# EAGLE design sanguino_breakout (EAGLE 5.02)
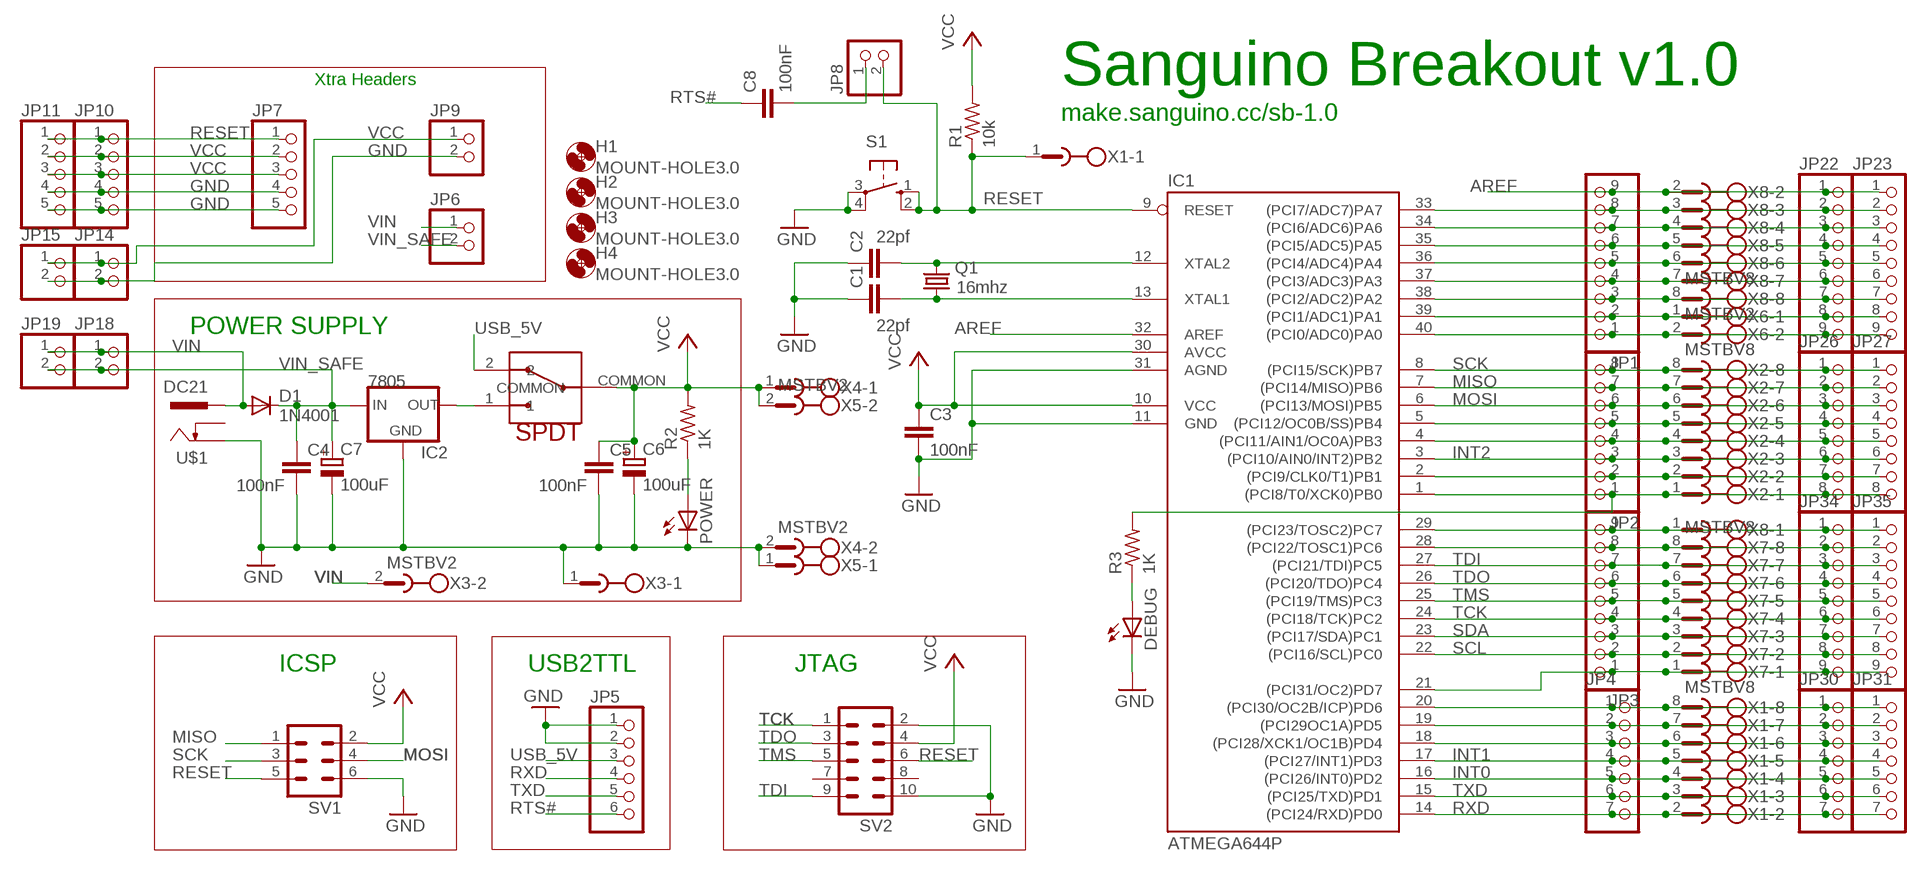
[diagram p0: schematic, sheet 1]

## Parts
C1  22pf  C-EU025-025X050  [C025-025X050]
C2  22pf  C-EU025-025X050  [C025-025X050]
C3  100nF  C-EU050-030X075  [C050-030X075]
C4  100nF  C-EU050-030X075  [C050-030X075]
C5  100nF  C-EU050-030X075  [C050-030X075]
C6  100uF  CPOL-EUE2.5-6  [E2,5-6]
C7  100uF  CPOL-EUE2.5-6  [E2,5-6]
C8  100nF  C-EU050-030X075  [C050-030X075]
D1  1N4001  1N4004  [DO41-10]
DEBUG  LED3MM  [LED3MM]
H1  MOUNT-HOLE3.0  [3,0]
H2  MOUNT-HOLE3.0  [3,0]
H3  MOUNT-HOLE3.0  [3,0]
H4  MOUNT-HOLE3.0  [3,0]
IC1  ATMEGA644P  ATMEGA644-20P  [DIL40]
IC2  7805  V_REG_78XXSINK  [TO220-IGO]
JP1  PINHD-1X9  [1X09]
JP2  PINHD-1X8  [1X08]
JP3  PINHD-1X9  [1X09]
JP4  PINHD-1X7  [1X07]
JP5  PINHD-1X6  [1X06]
JP6  PINHD-1X2  [1X02]
JP7  PINHD-1X5  [1X05]
JP8  PINHD-1X2  [1X02]
JP9  PINHD-1X2  [1X02]
JP10  PINHD-1X5  [1X05]
JP11  PINHD-1X5  [1X05]
JP14  PINHD-1X2  [1X02]
JP15  PINHD-1X2  [1X02]
JP18  PINHD-1X2  [1X02]
JP19  PINHD-1X2  [1X02]
JP22  PINHD-1X9  [1X09]
JP23  PINHD-1X9  [1X09]
JP26  PINHD-1X8  [1X08]
JP27  PINHD-1X8  [1X08]
JP30  PINHD-1X7  [1X07]
JP31  PINHD-1X7  [1X07]
JP34  PINHD-1X9  [1X09]
JP35  PINHD-1X9  [1X09]
POWER  LED3MM  [LED3MM]
Q1  16mhz  CRYSTALHC49S  [HC49/S]
R1  10k  R-US_0207/7  [0207/7]
R2  1K  R-US_0207/2V  [0207/2V]
R3  1K  R-US_0207/2V  [0207/2V]
S1  10-XX  [B3F-10XX]
SV1  ML6  [ML6]
SV2  ML10  [ML10]
U$1  DC21  [DCSKT]
U$2  SPDT  [10SP001]
X1  MSTBV8  [MSTBV8]
X2  MSTBV8  [MSTBV8]
X3  MSTBV2  [MSTBV2]
X4  MSTBV2  [MSTBV2]
X5  MSTBV2  [MSTBV2]
X6  MSTBV2  [MSTBV2]
X7  MSTBV8  [MSTBV8]
X8  MSTBV8  [MSTBV8]

## Nets
AREF: IC1.32(AREF) JP1.9 JP22.1 JP23.1 X8.2
GND [power]: C1.1 C2.1 C3.2 C4.2 C5.2 C6.- C7.- DEBUG.K(C) IC1.11(GND) IC1.31(AGND) IC2.GND JP5.1 JP5.2 JP7.4 JP7.5 JP9.2 JP10.4 JP10.5 JP11.4 JP11.5 JP14.2 JP15.2 POWER.K(C) S1.3(P) S1.4(P1) SV1.6 SV2.2 SV2.10 U$1.2 X3.1 X4.2 X5.1
INT0: IC1.16((PCI26/INT0)PD2) JP4.5 JP30.5 JP31.5 X1.4
INT1: IC1.17((PCI27/INT1)PD3) JP4.4 JP30.4 JP31.4 X1.5
INT2: IC1.3((PCI10/AIN0/INT2)PB2) JP2.3 JP26.6 JP27.6 X2.3
MISO: IC1.7((PCI14/MISO)PB6) JP2.7 JP26.2 JP27.2 SV1.1 X2.7
MOSI: IC1.6((PCI13/MOSI)PB5) JP2.6 JP26.3 JP27.3 SV1.4 X2.6
N$1: C2.2 IC1.12(XTAL2) Q1.2
N$2: IC1.33((PCI7/ADC7)PA7) JP1.8 JP22.2 JP23.2 X8.3
N$3: IC1.34((PCI6/ADC6)PA6) JP1.7 JP22.3 JP23.3 X8.4
N$4: POWER.A R2.1
N$5: C1.2 IC1.13(XTAL1) Q1.1
N$6: IC1.35((PCI5/ADC5)PA5) JP1.6 JP22.4 JP23.4 X8.5
N$7: DEBUG.A R3.1
N$8: IC1.37((PCI3/ADC3)PA3) JP1.4 JP22.6 JP23.6 X8.7
N$9: IC1.38((PCI2/ADC2)PA2) JP1.3 JP22.7 JP23.7 X8.8
N$10: IC1.39((PCI1/ADC1)PA1) JP1.2 JP22.8 JP23.8 X6.1
N$11: IC1.40((PCI0/ADC0)PA0) JP1.1 JP22.9 JP23.9 X6.2
N$12: IC1.5((PCI12/OC0B/SS)PB4) JP2.5 JP26.4 JP27.4 X2.5
N$13: IC1.4((PCI11/AIN1/OC0A)PB3) JP2.4 JP26.5 JP27.5 X2.4
N$15: IC1.2((PCI9/CLK0/T1)PB1) JP2.2 JP26.7 JP27.7 X2.2
N$16: IC1.1((PCI8/T0/XCK0)PB0) JP2.1 JP26.8 JP27.8 R3.2 X2.1
N$17: IC1.29((PCI23/TOSC2)PC7) JP3.9 JP34.1 JP35.1 X8.1
N$18: IC1.28((PCI22/TOSC1)PC6) JP3.8 JP34.2 JP35.2 X7.8
N$19: IC1.21((PCI31/OC2)PD7) JP3.1 JP34.9 JP35.9 X7.1
N$20: IC1.36((PCI4/ADC4)PA4) JP1.5 JP22.5 JP23.5 X8.6
N$21: C8.2 JP8.1
N$22: IC2.OUT U$2.1
N$26: IC1.20((PCI30/OC2B/ICP)PD6) JP4.1 JP30.1 JP31.1 X1.8
N$27: IC1.19((PCI29OC1A)PD5) JP4.2 JP30.2 JP31.2 X1.7
N$28: IC1.18((PCI28/XCK1/OC1B)PD4) JP4.3 JP30.3 JP31.3 X1.6
RESET: IC1.9(RESET) JP7.1 JP8.2 JP10.1 JP11.1 R1.1 S1.1(S) S1.2(S1) SV1.5 SV2.6 X1.1
RTS#: C8.1 JP5.6
RXD: IC1.14((PCI24/RXD)PD0) JP4.7 JP5.4 JP30.7 JP31.7 X1.2
SCK: IC1.8((PCI15/SCK)PB7) JP2.8 JP26.1 JP27.1 SV1.3 X2.8
SCL: IC1.22((PCI16/SCL)PC0) JP3.2 JP34.8 JP35.8 X7.2
SDA: IC1.23((PCI17/SDA)PC1) JP3.3 JP34.7 JP35.7 X7.3
TCK: IC1.24((PCI18/TCK)PC2) JP3.4 JP34.6 JP35.6 SV2.1 X7.4
TDI: IC1.27((PCI21/TDI)PC5) JP3.7 JP34.3 JP35.3 SV2.9 X7.7
TDO: IC1.26((PCI20/TDO)PC4) JP3.6 JP34.4 JP35.4 SV2.3 X7.6
TMS: IC1.25((PCI19/TMS)PC3) JP3.5 JP34.5 JP35.5 SV2.5 X7.5
TXD: IC1.15((PCI25/TXD)PD1) JP4.6 JP5.5 JP30.6 JP31.6 X1.3
USB_5V: JP5.3 U$2.2
VCC [power]: C3.1 C5.1 C6.+ IC1.10(VCC) IC1.30(AVCC) JP7.2 JP7.3 JP9.1 JP10.2 JP10.3 JP11.2 JP11.3 JP14.1 JP15.1 R1.2 R2.2 SV1.2 SV2.4 U$2.COMMON X4.1 X5.2
VIN [power]: D1.A JP6.1 JP18.1 JP19.1 U$1.1 X3.2
VIN_SAFE [power]: C4.1 C7.+ D1.C IC2.IN JP6.2 JP18.2 JP19.2
Unconnected: SV2.7 SV2.8 U$1.3

## Notes on the sheet
- Xtra Headers | Sanguino Breakout v1.0
- make.sanguino.cc/sb-1.0
- POWER SUPPLY
- ICSP | USB2TTL | JTAG

## Library data of the parts
C1-C5 C8 = rcl:C-EU: CAPACITOR, European symbol
C6 C7 = rcl:CPOL-EU: POLARIZED CAPACITOR, European symbol
D1 = diode:1N4004: DIODE general purpose rectifier, 1 A
DEBUG POWER = led:LED: LED OSRAM: - CHIPLED LG R971, LG N971, LY N971, LG Q971, LY Q971, LO R971, LY R971 LH N974, LH R974 LS Q976, LO Q976, LY Q976 LO Q996 - Hyper CHIPLED LW Q18S LB Q993, LB Q99A, LB R99A - SideLED LS A670, LO A670, LY A670, LG A670, LP A670 LB A673, LV A673, LT A673, LW A673 LH A674 LY A675 LS A676, LA A676, LO A676, LY A676, LW A676 LS A679, LY A679, LG A679 - Hyper Micro SIDELED® LS Y876, LA Y876, LO Y876, LY Y876 LT Y87S - SmartLED LW L88C, LW L88S LB L89C, LB L89S, LG L890 LS L89K, LO L89K, LY L89K LS L896, LA L896, LO L896, LY L896 - TOPLED LS T670, LO T670, LY T670, LG T670, LP T670 LSG T670, LSP T670, LSY T670, LOP T670, LYG T670 LG T671, LOG T671, LSG T671 LB T673, LV T673, LT T673, LW T673 LH T674 LS T676, LA T676, LO T676, LY T676, LB T676, LH T676, LSB T676, LW T676 LB T67C, LV T67C, LT T67C, LS T67K, LO T67K, LY T67K, LW E67C LS E67B, LA E67B, LO E67B, LY E67B, LB E67C, LV E67C, LT E67C LW T67C LS T679, LY T679, LG T679 LS T770, LO T770, LY T770, LG T770, LP T770 LB T773, LV T773, LT T773, LW T773 LH T774 LS E675, LA E675, LY E675, LS T675 LS T776, LA T776, LO T776, LY T776, LB T776 LHGB T686 LT T68C, LB T68C - Hyper Mini TOPLED® LB M676 - Mini TOPLED Santana® LG M470 LS M47K, LO M47K, LY M47K Source: http://www.osram.convergy.de - LUMILED® LXK2-PW12-R00, LXK2-PW12-S00, LXK2-PW14-U00, LXK2-PW14-V00 LXK2-PM12-R00, LXK2-PM12-S00, LXK2-PM14-U00 LXK2-PE12-Q00, LXK2-PE12-R00, LXK2-PE12-S00, LXK2-PE14-T00, LXK2-PE14-U00 LXK2-PB12-K00, LXK2-PB12-L00, LXK2-PB12-M00, LXK2-PB14-N00, LXK2-PB14-P00, LXK2-PB14-Q00 LXK2-PR12-L00, LXK2-PR12-M00, LXK2-PR14-Q00, LXK2-PR14-R00 LXK2-PD12-Q00, LXK2-PD12-R00, LXK2-PD12-S00 LXK2-PH12-R00, LXK2-PH12-S00 LXK2-PL12-P00, LXK2-PL12-Q00, LXK2-PL12-R00 Source: www.luxeon.com
H1-H4 = holes:MOUNT-HOLE: MOUNTING HOLE with drill center marker
IC1 = avr:ATMEGA644*P: MICROCONTROLLER 64 kBytes FLASH 4 kBytes SRAM 2 kBytes EEPROM DUAL USART 8-channel 10 bit ADC
IC2 = SparkFun:V_REG_78XX: Voltage Regulator Standard 7805 5V regulator. IGO (Input Ground Output). Spark Fun Electronics SKU : COM-00107
JP1 JP3 JP22 JP23 JP34 JP35 = pinhead:PINHD-1X9: PIN HEADER
JP2 JP26 JP27 = pinhead:PINHD-1X8: PIN HEADER
JP4 JP30 JP31 = pinhead:PINHD-1X7: PIN HEADER
JP5 = pinhead:PINHD-1X6: PIN HEADER
JP6 JP8 JP9 JP14 JP15 JP18 JP19 = pinhead:PINHD-1X2: PIN HEADER
JP7 JP10 JP11 = pinhead:PINHD-1X5: PIN HEADER
Q1 = crystal:CRYSTAL: CRYSTAL
R1 R2 = rcl:R-US_: RESISTOR, American symbol
R3 = resistor:R-US_: RESISTOR, American symbol
S1 = switch-omron:10-XX: OMRON SWITCH
SV1 = con-harting-ml:ML6: HARTING
SV2 = con-harting-ml:ML10: HARTING
U$1 = dcsocket:DC21: DC 2.1 mm Power Socket Negative Centre
U$2 = nycr:SPDT
X1 X2 X7 X8 = con-phoenix-508:MSTBV8: PHOENIX
X3-X6 = con-phoenix-508:MSTBV2: PHOENIX

## Net classes
0 default: width 0.635 mm, clearance 0.406 mm
1 power: width 0.635 mm, clearance 0.406 mm

## Board
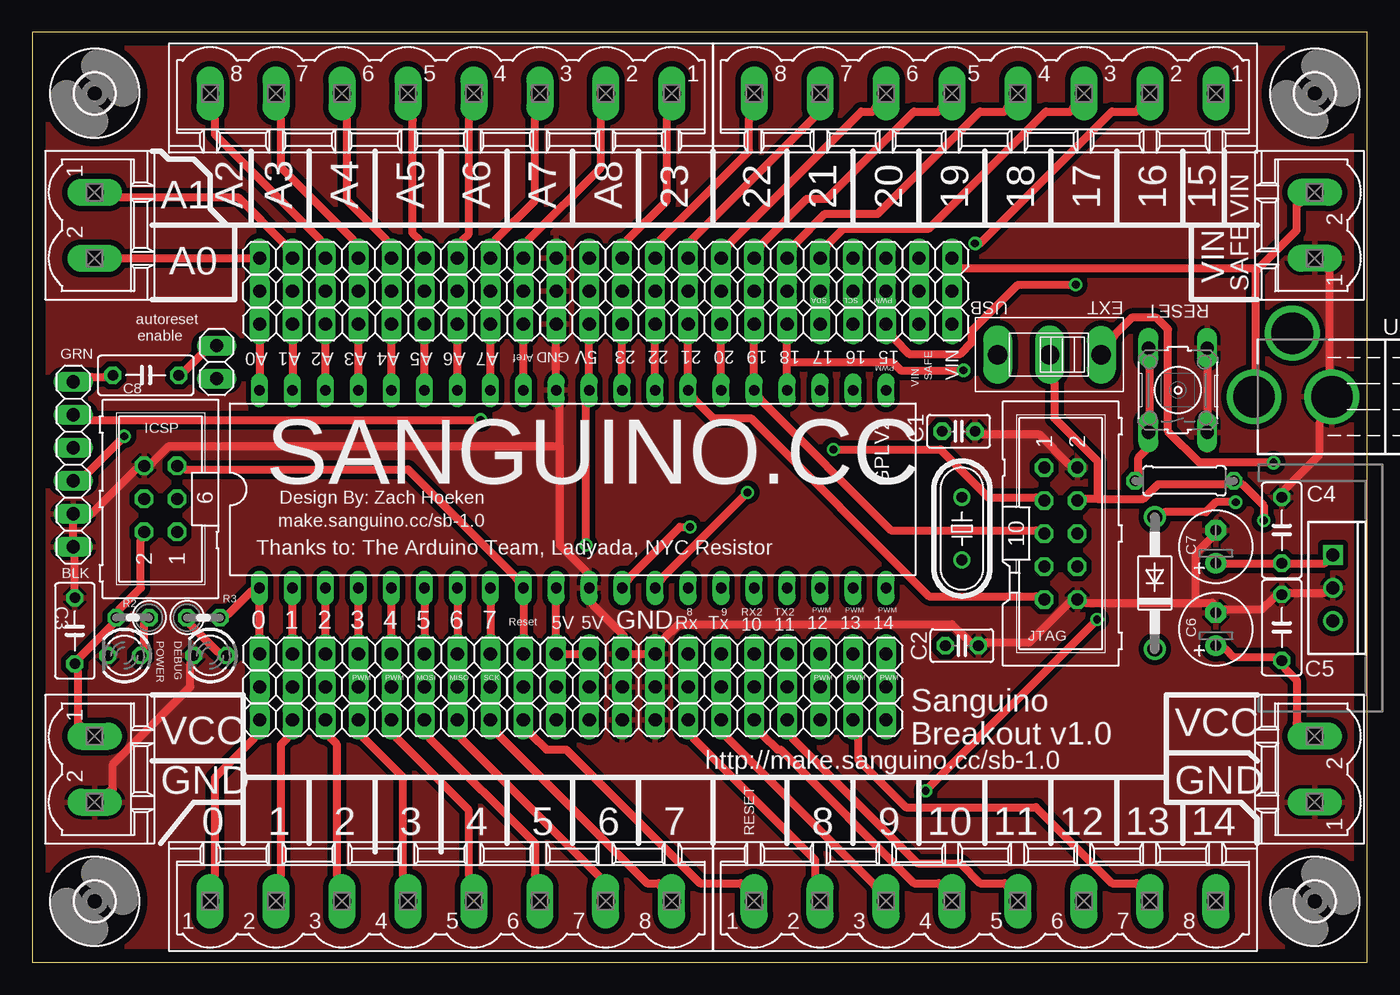
[diagram p1: board, top side]
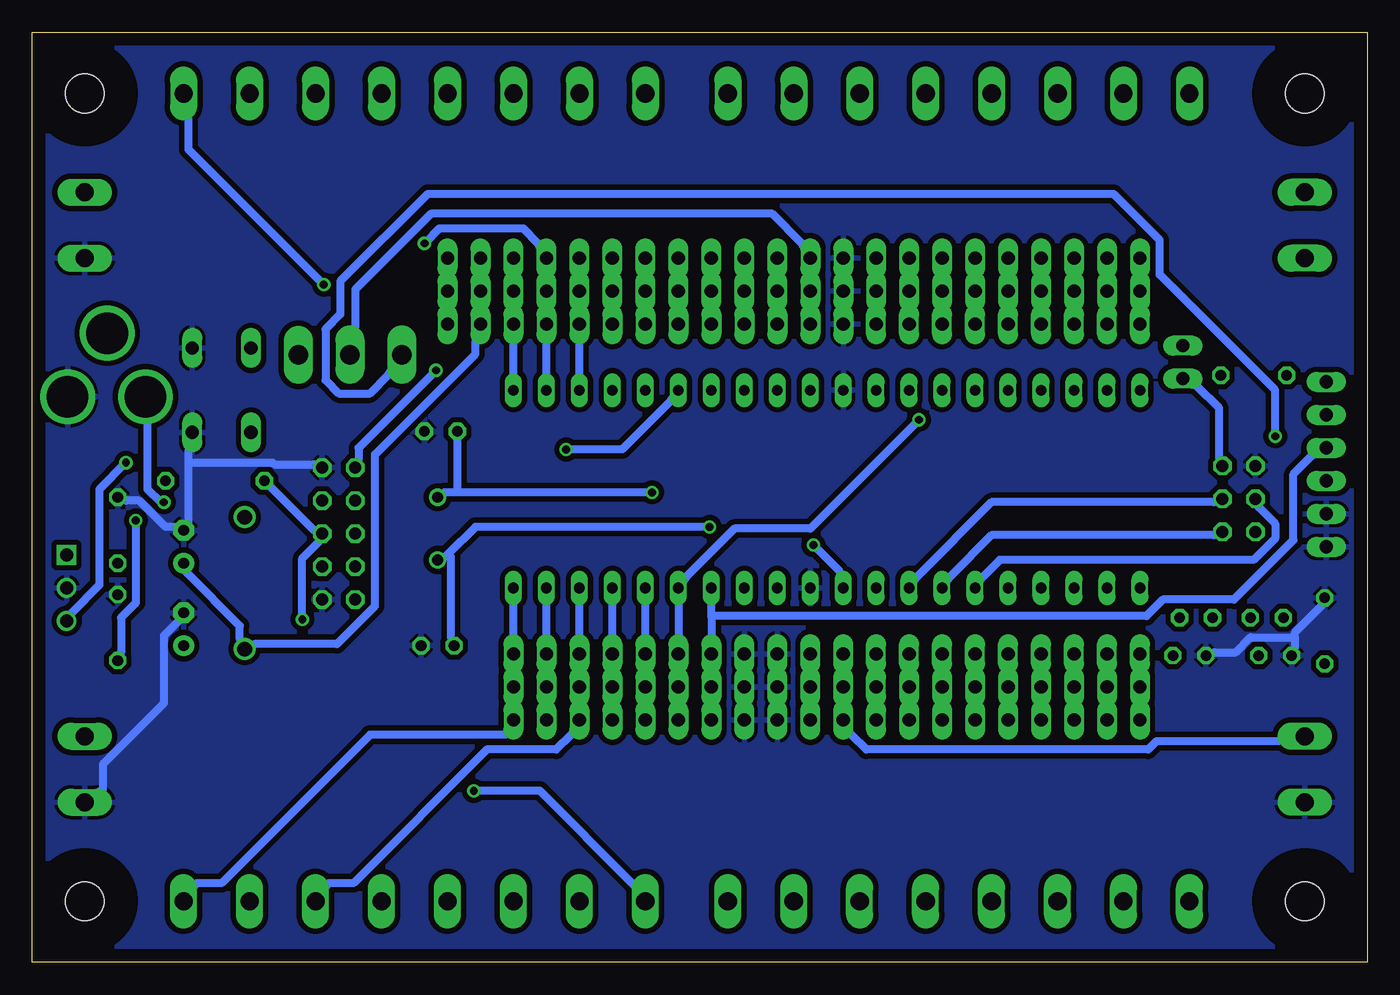
[diagram p2: board, bottom side, seen from below]

Size 102.79 x 71.62 mm. Coordinates in mm from the lower left corner, seen from the top.
Outline: 0,0 102.79,0 102.79,71.62 0,71.62 0,0
Copper layers (1*16): Top 0.035mm / dielectric 1.5mm / Bottom 0.035mm
Design rules "default *": minimum track width 10mil, minimum drill 24mil, track to track 10mil, track to pad 10mil, pad to pad 10mil, via to via 10mil, smd to smd 10mil, copper to edge 40mil, drill to drill 8mil, minimum pad ring 10mil, minimum via ring 8mil, stop-mask expansion 4mil, vias tented up to drill 0mil, thermal gap 10mil

### Footprints (pad centres in the part's own frame; a part is rotated, then mirrored left to right if it is on the bottom)
C025-025X050 = drill 0.813 octagon: 1 -1.27,0; 2 1.27,0
C050-030X075 = drill 0.813 octagon: 1 -2.54,0; 2 2.54,0
E2,5-6 = drill 0.813 pad 1.6 round: + -1.27,0 | drill 0.813 pad 1.6 octagon: - 1.27,0
DO41-10 = drill 1.118 round: A 5.08,0; C -5.08,0
LED3MM = drill 0.813 octagon: A -1.27,0; K 1.27,0
3,0 = hole 3: 0,0
DIL40 = drill 0.813 long: 1 -24.13,-7.62; 2 -21.59,-7.62; 3 -19.05,-7.62; 4 -16.51,-7.62; 5 -13.97,-7.62; 6 -11.43,-7.62; 7 -8.89,-7.62; 8 -6.35,-7.62; 9 -3.81,-7.62; 10 -1.27,-7.62; 11 1.27,-7.62; 12 3.81,-7.62; 13 6.35,-7.62; 14 8.89,-7.62; 15 11.43,-7.62; 16 13.97,-7.62; 17 16.51,-7.62; 18 19.05,-7.62; 19 21.59,-7.62; 20 24.13,-7.62; 21 24.13,7.62; 22 21.59,7.62; 23 19.05,7.62; 24 16.51,7.62; 25 13.97,7.62; 26 11.43,7.62; 27 8.89,7.62; 28 6.35,7.62; 29 3.81,7.62; 30 1.27,7.62; 31 -1.27,7.62; 32 -3.81,7.62; 33 -6.35,7.62; 34 -8.89,7.62; 35 -11.43,7.62; 36 -13.97,7.62; 37 -16.51,7.62; 38 -19.05,7.62; 39 -21.59,7.62; 40 -24.13,7.62
TO220-IGO = drill 1 round: GND 0,0; OUT 2.54,0 | drill 1 square: IN -2.54,0
1X09 = drill 1.016 long: 1 -10.16,0; 2 -7.62,0; 3 -5.08,0; 4 -2.54,0; 5 0,0; 6 2.54,0; 7 5.08,0; 8 7.62,0; 9 10.16,0
1X08 = drill 1.016 long: 1 -8.89,0; 2 -6.35,0; 3 -3.81,0; 4 -1.27,0; 5 1.27,0; 6 3.81,0; 7 6.35,0; 8 8.89,0
1X07 = drill 1.016 long: 1 -7.62,0; 2 -5.08,0; 3 -2.54,0; 4 0,0; 5 2.54,0; 6 5.08,0; 7 7.62,0
1X06 = drill 1.016 long: 1 -6.35,0; 2 -3.81,0; 3 -1.27,0; 4 1.27,0; 5 3.81,0; 6 6.35,0
1X02 = drill 1.016 long: 1 -1.27,0; 2 1.27,0
1X05 = drill 1.016 long: 1 -5.08,0; 2 -2.54,0; 3 0,0; 4 2.54,0; 5 5.08,0
HC49/S = drill 0.813 round: 1 -2.413,0; 2 2.413,0
0207/7 = drill 0.813 octagon: 1 -3.81,0; 2 3.81,0
0207/2V = drill 0.813 octagon: 1 -1.27,0; 2 1.27,0
B3F-10XX = drill 1.016 long: 1 -3.251,2.261; 2 3.251,2.261; 3 -3.251,-2.261; 4 3.251,-2.261
ML6 = drill 0.914 octagon: 1 -2.54,-1.27; 2 -2.54,1.27; 3 0,-1.27; 4 0,1.27; 5 2.54,-1.27; 6 2.54,1.27
ML10 = drill 0.914 octagon: 1 -5.08,-1.27; 2 -5.08,1.27; 3 -2.54,-1.27; 4 -2.54,1.27; 5 0,-1.27; 6 0,1.27; 7 2.54,-1.27; 8 2.54,1.27; 9 5.08,-1.27; 10 5.08,1.27
DCSKT = drill 3.2 round: 1 0,6.08; 2 0,0.08; 3 4.9,3.13
10SP001 = drill 1.5 long: 1 1.71,2.86; 2 9.69,2.85; COMMON 5.7,2.85
MSTBV8 = drill 1.397 long: 1 -17.78,0; 2 -12.7,0; 3 -7.62,0; 4 -2.54,0; 5 2.54,0; 6 7.62,0; 7 12.7,0; 8 17.78,0
MSTBV2 = drill 1.397 long: 1 -2.54,0; 2 2.54,0

### Placement (x,y rotation side)
C1  71.34,40.89 180 top
C2  71.59,24.38 180 top
C3  3.26,25.52 90 top
C4  96.23,33.27 90 top
C5  96.23,25.78 90 top
C6  91.15,25.65 90 top
C7  91.15,32 90 top
C8  8.72,45.21 0 top
D1  86.45,29.2 90 top
DEBUG  13.68,23.62 180 top
H1  4.79,4.69 0 top
H2  98.77,4.69 0 top
H3  98.77,66.92 0 top
H4  4.79,66.92 0 top
IC1  41.62,36.44 0 top
IC2  100.16,28.82 270 top
JP1  27.65,49.14 0 top
JP2  26.38,23.74 0 top
JP3  55.59,49.14 180 top
JP4  58.13,23.74 180 top
JP5  3.14,38.35 90 top
JP6  69.56,49.14 180 top
JP7  42.89,23.74 0 top
JP8  14.19,46.22 270 top
JP9  41.62,49.14 180 top
JP10  42.89,21.2 0 top
JP11  42.89,18.66 0 top
JP14  41.62,51.68 180 top
JP15  41.62,54.22 180 top
JP18  69.56,51.68 180 top
JP19  69.56,54.22 180 top
JP22  27.65,51.68 180 top
JP23  27.65,54.22 180 top
JP26  26.38,21.2 180 top
JP27  26.38,18.66 180 top
JP30  58.13,21.2 180 top
JP31  58.13,18.66 180 top
JP34  55.59,51.68 0 top
JP35  55.59,54.22 0 top
POWER  7.07,23.62 180 top
Q1  71.59,33.4 270 top
R1  88.73,37.08 0 top
R2  7.71,26.54 180 top
R3  13.17,26.54 0 top
S1  88.23,44.06 90 top
SV1  9.87,35.68 90 top
SV2  79.21,33.02 270 top
U$1  100.16,43.56 90 top
U$2  84.04,49.65 180 top
X1  73.37,4.69 0 top
X2  31.46,4.69 0 top
X3  98.77,56.76 90 top
X4  4.79,14.85 270 top
X5  98.77,14.85 90 top
X6  4.79,56.76 270 top
X7  73.37,66.92 180 top
X8  31.46,66.92 180 top

### Tracks (layer width: path | path; a pad name or v marks a point on that pad's centre or on a via)
AREF
  Top 0.635: IC1.32 JP1.9 JP22.1 JP23.1 38.19,55.62 43.78,61.21 43.78,64.89 X8.2
GND
  Top 0.635: IC2.GND 99.53,28.44 96.86,28.44 C5.2 95.59,28.06 94.7,27.17 91.91,27.17 C6.- 90.89,27.68 89.62,27.68 | 89.62,27.68 81.11,27.68 SV2.10 79.84,27.68 76.8,24.63 73.49,24.63 C2.1 72.22,24.63 70.83,26.03 49.75,26.03 48.6,24.89 JP7.5 | X3.1 99.91,53.21 99.91,45.59 U$1.2 99.15,41.52 99.15,39.11 96.48,36.44 C4.2 | C1.1 73.24,40.64 77.56,40.64 79.84,38.35 SV2.2 | S1.3 90.51,42.29 90.51,45.84 S1.4 | 89.62,27.68 89.62,31.49 90.77,32.63 C7.- | C3.2 3.26,31.36 JP5.1 JP5.2 4.53,34.54 7.96,37.97 SV1.6 9.23,38.48 10.5,39.75 40.6,39.75 | X4.2 6.18,13.33 6.18,15.23 12.15,21.2 12.15,22.98 DEBUG.K | JP15.2 JP14.2 JP9.2 IC1.31 40.6,42.79 40.6,39.75 | JP11.5 JP10.5 JP7.5 | JP11.4 JP10.4 JP7.4 | JP7.4 45.55,25.14 43.14,27.55 IC1.11 42.63,30.09 40.6,32.13 40.6,39.75 | JP7.4 JP7.5
  Bottom 0.635: X5.1 97.37,13.33 97.37,15.23 92.67,19.93 92.67,25.14 91.53,26.28 C6.- | C4.2 95.59,35.56 94.58,35.56 92.54,33.52 91.91,33.52 C7.- 90.77,33.9 90.77,38.48 | 90.77,38.48 90.77,39.36 S1.3 | SV2.2 81.11,38.35 84.16,38.35 84.29,38.48 90.77,38.48 | 5.55,25.01 5.55,25.39 3.52,27.43 C3.2 | 5.55,25.01 5.55,24.25 POWER.K | DEBUG.K 11.77,23.87 10.12,23.87 8.98,25.01 5.55,25.01
  pour Top: -0.29,72 103.85,72 103.85,-0.39 -0.29,-0.39
  pour Bottom: -0.29,72 103.85,72 103.85,-0.39 -0.29,-0.39
INT0
  Top 0.635: JP4.5 JP30.5 JP31.5 56.22,17.52 57.37,16.38 57.62,16.38 67.91,6.09 69.81,6.09 X1.4
  Bottom 0.635: JP4.5 IC1.16
INT1
  Top 0.635: JP4.4 JP30.4 JP31.4 58.51,17.27 68.16,7.62 71.46,7.62 72.99,6.09 74.89,6.09 X1.5
  Bottom 0.635: JP4.4 IC1.17
INT2
  Top 0.635: IC1.3 JP2.3 JP26.6 JP27.6 22.95,17.27 23.46,16.76 23.46,6.73 X2.3
MISO
  Top 0.635: IC1.7 JP2.7 JP26.2 JP27.2 32.98,17.27 43.65,6.6 X2.7
  Bottom 0.635: SV1.1 11.77,32.89 28.92,32.89 32.09,29.71 IC1.7
MOSI
  Top 0.635: IC1.6 JP2.6 JP26.3 JP27.3 30.57,17.27 38.7,9.14 38.7,6.73 X2.6
  Bottom 0.635: SV1.4 8.34,35.05 7.07,33.78 7.07,32.63 8.72,30.98 28.28,30.98 29.55,29.71 IC1.6
N$1  (via drill 0.61)
  Top 0.635: v50.63,33.52 49.87,33.52 46.06,29.71 IC1.12
  Bottom 0.635: v50.63,33.52 68.67,33.52 70.77,31.43 | 70.77,31.43 70.95,31.24 Q1.2 | C2.2 70.57,25.01 70.57,31.24 70.77,31.43
N$2
  Top 0.635: IC1.33 JP1.8 JP22.2 JP23.2 35.65,55.62 38.7,58.67 38.7,64.89 X8.3
N$3
  Top 0.635: IC1.34 JP1.7 JP22.3 JP23.3 33.11,55.62 33.62,56.13 33.62,64.89 X8.4
N$4
  Top 0.635: POWER.A 8.6,24.25 8.6,26.03 R2.1
N$5  (via drill 0.61)
  Top 0.635: v55.08,36.19 48.6,29.71 IC1.13
  Bottom 0.635: 70.07,36.19 71.08,36.19 Q1.1 | v55.08,36.19 70.07,36.19 | 70.07,36.19 C1.2
N$6
  Top 0.635: IC1.35 JP1.6 JP22.4 JP23.4 29.81,55.62 29.3,56.13 29.3,64.89 X8.5
N$7
  Top 0.635: DEBUG.A 14.31,23.87 12.15,26.03 R3.1
N$8
  Top 0.635: IC1.37 JP1.4 JP22.6 JP23.6 24.73,55.62 19.14,61.21 19.14,64.89 X8.7
N$9
  Top 0.635: IC1.38 JP1.3 JP22.7 JP23.7 22.19,55.62 14.06,63.75 14.06,64.89 X8.8
N$10
  Top 0.635: IC1.39 JP1.2 JP22.8 JP23.8 19.39,55.37 15.84,58.92 6.82,58.92 X6.1
N$11
  Top 0.635: IC1.40 JP1.1 JP22.9 JP23.9 X6.2
N$12
  Top 0.635: IC1.5 JP2.5 JP26.4 JP27.4 28.03,17.27 33.62,11.68 33.62,6.73 X2.5
N$13
  Top 0.635: IC1.4 JP2.4 JP26.5 JP27.5 25.49,17.27 28.54,14.22 28.54,6.73 X2.4
N$15
  Top 0.635: IC1.2 JP2.2 JP26.7 JP27.7 19.65,17.27 19.14,16.76 19.14,6.73 X2.2
N$16
  Top 0.635: R3.2 15.07,26.79 16.85,28.57 IC1.1 JP2.1 JP26.8 JP27.8 17.11,17.27 14.06,14.22 14.06,6.73 X2.1
N$17
  Top 0.635: IC1.29 JP3.9 JP34.1 JP35.1 45.81,55.62 48.86,58.67 48.86,64.89 X8.1
N$18
  Top 0.635: IC1.28 JP3.8 JP34.2 JP35.2 48.35,55.62 55.21,62.48 55.21,64.89 X7.8
N$19  (via drill 0.61)
  Top 0.635: JP35.9 JP34.9 JP3.1 66.38,48 67.53,46.86 71.46,46.86 72.35,47.75 72.35,48.64 75.91,52.19 v80.35,52.19
  Bottom 0.635: IC1.21 JP3.1 | v80.35,52.19 90.77,62.61 90.77,64.89 X7.1
N$20
  Top 0.635: IC1.36 JP1.5 JP22.5 JP23.5 27.27,55.62 24.22,58.67 24.22,64.89 X8.6
N$21
  Top 0.635: C8.2 11.77,45.59 13.04,46.86 JP8.1
N$22  (via drill 0.61)
  Top 0.635: v95.59,38.48 89.88,38.48 87.46,40.89 87.46,48.76 86.58,49.65 84.67,49.65 83.4,48.38 U$2.1
  Bottom 0.635: v95.59,38.48 97.62,36.44 97.62,29.08 99.78,26.92 IC2.OUT
N$26
  Top 0.635: JP31.1 JP30.1 JP4.1
  Bottom 0.635: JP4.1 IC1.20 | X1.8 90.13,6.09 88.23,6.09 76.8,17.52 66.38,17.52 JP31.1
N$27
  Top 0.635: JP4.2 JP30.2 JP31.2 63.59,17.27 63.59,15.62 67.27,11.93 77.3,11.93 83.15,6.09 85.05,6.09 X1.7
  Bottom 0.635: JP4.2 IC1.19
N$28
  Top 0.635: JP31.3 JP30.3 JP4.3
  Bottom 0.635: JP4.3 IC1.18 | X1.6 79.97,6.09 78.07,6.09 67.78,16.38 62.45,16.38 61.3,17.52 JP31.3
RESET  (via drill 0.61)
  Top 0.635: R1.1 85.18,37.71 85.18,38.86 85.69,39.36 S1.1 86.07,42.29 86.07,45.84 S1.2 | X1.1 54.57,6.09 51.4,6.09 41.11,16.38 39.59,16.38 38.44,17.52 JP11.1 JP10.1 JP7.1 IC1.9 37.17,29.71 28.92,37.97 11.77,37.97 SV1.5 | v68.8,13.2 v82,26.41
  Bottom 0.635: R1.1 81.11,33.27 SV2.6 80.73,32.38 82,31.11 v82,26.41 | SV1.5 11.39,38.86 11.39,42.67 13.04,44.32 JP8.2 | v68.8,13.2 63.72,13.2 56.6,6.09 X1.1
RTS#
  Top 0.635: C8.1 5.55,45.08 4.53,45.08 JP5.6
RXD
  Top 0.635: JP4.7 JP30.7 JP31.7 50.89,17.27 60.29,7.87 60.29,6.73 X1.2
  Bottom 0.635: 50.51,26.66 IC1.14 | 50.51,26.66 JP4.7 | JP5.4 4.28,38.98 5.68,37.59 5.68,32.51 10.25,27.93 15.71,27.93 16.98,26.66 50.51,26.66
SCK
  Top 0.635: IC1.8 JP2.8 JP26.1 JP27.1 35.9,17.52 47.33,6.09 48.22,6.09 X2.8
  Bottom 0.635: SV1.3 11.77,35.43 28.92,35.43 34.63,29.71 IC1.8
SCL  (via drill 0.61)
  Top 0.635: JP35.8 JP34.8 JP3.2 | v72.61,55.37 72.99,55.37 83.15,65.53 85.05,65.53 X7.2
  Bottom 0.635: IC1.22 JP3.2 | v72.61,55.37 71.46,56.51 64.99,56.51 63.84,55.37 JP35.8
SDA
  Top 0.635: JP3.3 JP34.7 JP35.7 61.3,55.37 62.45,56.51 69.05,56.51 78.07,65.53 79.97,65.53 X7.3
  Bottom 0.635: IC1.23 JP3.3
TCK  (via drill 0.61)
  Top 0.635: IC1.24 58.13,46.22 | 58.13,46.22 JP3.4 JP34.6 JP35.6 58.76,55.37 61.05,57.65 65.11,57.65 72.99,65.53 74.89,65.53 X7.4 | v71.72,45.59 66.89,45.59 66.26,46.22 58.13,46.22
  Bottom 0.635: v71.72,45.59 77.69,39.62 77.69,38.73 SV2.1
TDI
  Top 0.635: SV2.9 77.3,28.19 69.05,28.19 55.33,41.91 52.41,41.91 51.14,43.17 IC1.27 JP3.7 JP34.3 JP35.3 50.76,55.62 60.16,65.02 X7.7
TDO  (via drill 0.61)
  Top 0.635: IC1.26 JP3.6 JP34.4 JP35.4 53.68,55.37 63.84,65.53 64.73,65.53 X7.6 | v61.68,39.49 69.94,39.49 73.62,35.81 77.3,35.81 SV2.3
  Bottom 0.635: v61.68,39.49 57.37,39.49 53.68,43.17 IC1.26
TMS
  Top 0.635: SV2.5 77.3,33.27 66.13,33.27 56.22,43.17 IC1.25 JP3.5 JP34.5 JP35.5 56.22,55.37 59.65,58.8 61.18,58.8 67.91,65.53 69.81,65.53 X7.5
TXD  (via drill 0.61)
  Top 0.635: v34.51,41.78 4.53,41.78 JP5.5 | JP4.6 JP30.6 JP31.6 53.43,17.39 64.73,6.09 X1.3
  Bottom 0.635: JP4.6 IC1.15 52.41,29.71 48.73,33.4 42.89,33.4 v34.51,41.78
USB_5V  (via drill 0.61)
  Top 0.635: v7.07,40.51 4.28,37.71 JP5.3
  Bottom 0.635: v7.07,40.51 7.07,44.06 15.96,52.95 15.96,55.62 19.52,59.18 72.35,59.18 79.08,52.45 79.08,49.91 80.23,48.76 80.23,44.83 79.21,43.81 76.8,43.81 75.4,45.21 U$2.2
VCC  (via drill 0.61)
  Top 0.635: C6.+ 91.91,24.12 92.54,23.49 95.59,23.49 C5.1 96.48,22.6 97.37,21.71 97.37,18.41 X5.2 | 82,35.68 81.11,35.68 SV2.4 | 82,35.68 85.56,35.68 86.7,36.83 91.91,36.83 R1.2 93.18,36.83 94.83,35.17 v94.83,34.03 | U$2.COMMON 78.7,44.57 78.7,41.91 82,38.6 82,35.68 | SV1.2 8.34,32.51 8.34,28.82 6.69,27.17 R2.2 6.18,26.03 3.64,23.49 C3.1 3.52,22.35 3.52,18.41 X4.1 | JP15.1 JP14.1 JP9.1 IC1.30 42.63,42.79 v42.63,32.13 | JP11.3 JP10.3 JP7.3 JP7.2 | JP11.2 JP10.2 JP7.2 | JP7.2 IC1.10
  Bottom 0.635: v94.83,34.03 94.83,27.68 95.97,26.54 95.97,23.87 C5.1 | v42.63,32.13 40.6,30.09 IC1.10 | X4.1 6.82,17.01 16.22,17.01 16.85,16.38 38.57,16.38 39.71,17.52 JP11.2 | U$2.COMMON 77.94,49.02 77.94,51.81 72.1,57.65 45.81,57.65 43.52,55.37 JP15.1
VIN  (via drill 0.61)
  Top 0.635: JP6.1 JP18.1 JP19.1 71.46,53.46 94.07,53.46 94.26,53.27 | v92.67,35.43 91.15,35.43 90.39,34.67 87.21,34.67 D1.A | 94.26,53.27 94.2,53.21 94.2,45.59 U$1.1 | 94.26,53.27 97.37,56.38 97.37,58.29 X3.2
  Bottom 0.635: v92.67,35.43 92.93,35.43 93.94,36.44 93.94,41.52 U$1.1
VIN_SAFE
  Top 0.635: JP6.2 JP18.2 JP19.2 | IC2.IN 99.53,30.73 C4.1 C7.+
  Bottom 0.635: C7.+ 90.89,29.97 86.83,25.9 86.83,24.89 D1.C 85.69,24.51 79.34,24.51 76.42,27.43 76.42,39.11 68.67,46.86 68.67,47.75 JP6.2

### Text on the board
tPlace: A1 | A2 | A3 | A4 | A5 | A6 | A7 | A8 | 23 | 22 | 21 | 20 | 19 | 18 | 17 | 16 | 15 | VIN | A0 | VIN | SAFE | SDA | SCL | PWM | USB | EXT | RESET | autoreset | enable | A0 | A1 | A2 | A3 | A4 | A5 | A6 | A7 | Aref | GND | 5V | 23 | 22 | 21 | 20 | 19 | 18 | 17 | 16 | 15 | GRN | PWM | SAFE | VIN | VIN | ICSP | SANGUINO.CC | GPLV2 | Design By: Zach Hoeken | make.sanguino.cc/sb-1.0 | Thanks to: The Arduino Team, Ladyada, NYC Resistor | BLK | C3 | 8 | 9 | RX2 | TX2 | PWM | PWM | PWM | Reset | 0 | 1 | 2 | 3 | 4 | 5 | 6 | 7 | 5V | 5V | GND | Rx | Tx | 10 | 11 | 12 | 13 | 14 | JTAG | PWM | PWM | MOSI | MISO | SCK | PWM | PWM | PWM | Sanguino | VCC | Breakout v1.0 | VCC | http://make.sanguino.cc/sb-1.0 | GND | GND | 0 | 1 | 2 | 3 | 4 | 5 | 6 | 7 | RESET | 8 | 9 | 10 | 11 | 12 | 13 | 14